# Altium schematic sheet Part18_I2C_IO_Expander.SchDoc
size A4
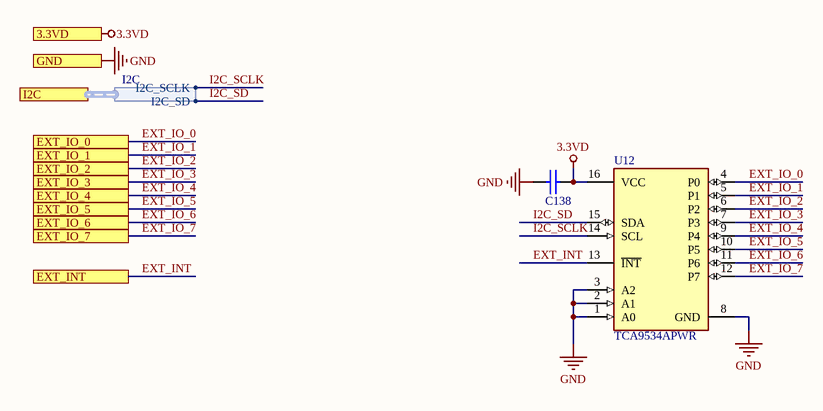
[diagram p0: Part18_I2C_IO_Expander.SchDoc]

## Parts
C138  100nF  [0402C]  (value not drawn)
U12  TCA9534APWR  [FP-PW0016A-MFG]

## Ports
3.3VD, EXT_INT, EXT_IO_0, EXT_IO_1, EXT_IO_2, EXT_IO_3, EXT_IO_4, EXT_IO_5, EXT_IO_6, EXT_IO_7, GND, I2C (harness I2C)

## Harnesses
I2C: I2C_SCLK, I2C_SD

## Nets
3.3VD: C138.2 U12.16(VCC) ; port 3.3VD
GND: C138.1 U12.1(A0) U12.2(A1) U12.3(A2) U12.8(GND) ; port GND
EXT_INT: U12.13(~{INT}) ; port EXT_INT
EXT_IO_0: U12.4(P0) ; port EXT_IO_0
EXT_IO_1: U12.5(P1) ; port EXT_IO_1
EXT_IO_2: U12.6(P2) ; port EXT_IO_2
EXT_IO_3: U12.7(P3) ; port EXT_IO_3
EXT_IO_4: U12.9(P4) ; port EXT_IO_4
EXT_IO_5: U12.10(P5) ; port EXT_IO_5
EXT_IO_6: U12.11(P6) ; port EXT_IO_6
EXT_IO_7: U12.12(P7) ; port EXT_IO_7
I2C_SCLK: U12.14(SCL) ; port I2C.I2C_SCLK
I2C_SD: U12.15(SDA) ; port I2C.I2C_SD

## Library data of the parts
C138 = CAP: 无极性电容
U12 = CMP-04886-000001-1: IC I/O EXPANDER I2C 8B 16TSSOP; Manufacturer: Texas Instruments; Max Junction Temp: 100°C; Interface: I2C,SMBus; Standoff Height: 0.05mm; Nominal Supply Current: 5-22uA; Number Of I/Os: 8; Max Supply Voltage: 5.5V; Min Supply Voltage: 1.65V; Frequency: 400kHz; Device Class L3: I/O Expanders; Octopart: https://octopart.com/tca9534apwr-texas+instruments-50333529; ComponentLink2URL: http://www.ti.com/lit/ds/symlink/tca9534a.pdf; ComponentLink2Description: Datasheet; Ambient Temperature Range Low: -40°C; Manufacturer Part Number: TCA9534APWR; Lead Free: Yes; Category: IC; Package: PW0016A; Automotive: No; Temperature Range Low: -40°C; Temperature Range High: +85°C; Device Class L2: Interface ICs; Temperature: -40°C to +85°C; RoHS: TRUE; Height: 1.2mm; Digikey Description: IC I/O EXPANDER I2C 8B 16TSSOP; Device Class L1: Integrated Circuits (ICs); Ambient Temperature Range High: +85°C